# Altium project Remute-RF-FT.PrjPcb
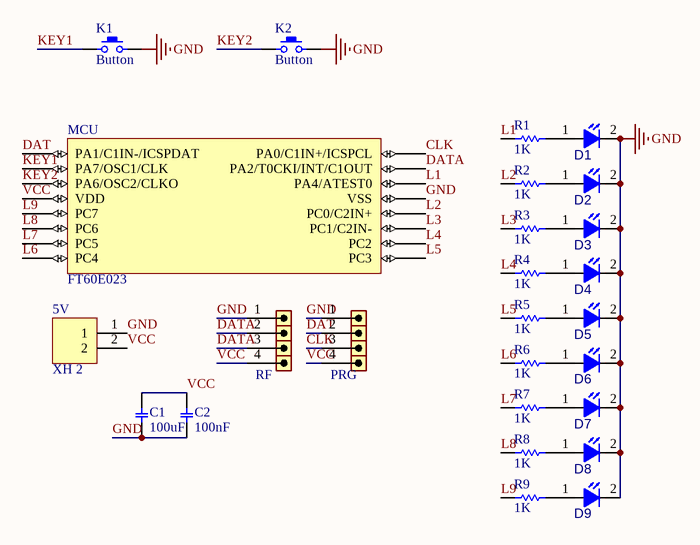
[diagram p0: Remute-RF-FT.SchDoc]
1 sheet, 26 parts. Net scope: global (net labels, ports and power ports of the same name join across sheets).
Board file: Remute-RF-FT.PcbDoc

## Sheet Remute-RF-FT.SchDoc
size C; SheetNumber: 1; SheetTotal: 1

### Parts
5V  XH 2  [XH 2 PIN ( White )]
C1  value 100uF  [C1206]  (hidden comment: Capacitor SMD 1206)
C2  value 100nF  [C1206]  (hidden comment: Capacitor SMD 1206)
D1  LED SMD 1206  [LED SMD 1206 (Blue)]  (value not drawn)
D2  LED SMD 1206  [LED SMD 1206 (Blue)]  (value not drawn)
D3  LED SMD 1206  [LED SMD 1206 (Blue)]  (value not drawn)
D4  LED SMD 1206  [LED SMD 1206 (Blue)]  (value not drawn)
D5  LED SMD 1206  [LED SMD 1206 (Blue)]  (value not drawn)
D6  LED SMD 1206  [LED SMD 1206 (Blue)]  (value not drawn)
D7  LED SMD 1206  [LED SMD 1206 (Blue)]  (value not drawn)
D8  LED SMD 1206  [LED SMD 1206 (Blue)]  (value not drawn)
D9  LED SMD 1206  [LED SMD 1206 (Blue)]  (value not drawn)
K1  Button  [BUTTON]
K2  Button  [BUTTON]
MCU  FT60E023  [SSOP-16]
PRG  Female Header Single 4  [HDR_F_1X4]  (value not drawn)
R1  value 1K  [R0805]  (hidden comment: Resistor SMD 0805)
R2  value 1K  [R0805]  (hidden comment: Resistor SMD 0805)
R3  value 1K  [R0805]  (hidden comment: Resistor SMD 0805)
R4  value 1K  [R0805]  (hidden comment: Resistor SMD 0805)
R5  value 1K  [R0805]  (hidden comment: Resistor SMD 0805)
R6  value 1K  [R0805]  (hidden comment: Resistor SMD 0805)
R7  value 1K  [R0805]  (hidden comment: Resistor SMD 0805)
R8  value 1K  [R0805]  (hidden comment: Resistor SMD 0805)
R9  value 1K  [R0805]  (hidden comment: Resistor SMD 0805)
RF  Female Header Single 4  [HDR_F_1X4]  (value not drawn)

### Nets
GND: 5V.1 C1.1 C2.1 D1.2(CATHODE) D2.2(CATHODE) D3.2(CATHODE) D4.2(CATHODE) D5.2(CATHODE) D6.2(CATHODE) D7.2(CATHODE) D8.2(CATHODE) D9.2(CATHODE) K1.2 K2.2 MCU.13(VSS) PRG.1 RF.1
CLK: MCU.16(PA0/C1IN+/ICSPCL) PRG.3
DAT: MCU.1(PA1/C1IN-/ICSPDAT) PRG.2
DATA: MCU.15(PA2/T0CKI/INT/C1OUT) RF.2 RF.3
KEY1: K1.1 MCU.2(PA7/OSC1/CLK)
KEY2: K2.1 MCU.3(PA6/OSC2/CLKO)
L1: MCU.14(PA4/ATEST0) R1.1
L2: MCU.12(PC0/C2IN+) R2.1
L3: MCU.11(PC1/C2IN-) R3.1
L4: MCU.10(PC2) R4.1
L5: MCU.9(PC3) R5.1
L6: MCU.8(PC4) R6.1
L7: MCU.7(PC5) R7.1
L8: MCU.6(PC6) R8.1
L9: MCU.5(PC7) R9.1
VCC: 5V.2 C1.2 C2.2 MCU.4(VDD) PRG.4 RF.4
NetD1_1: D1.1(ANODE) R1.2
NetD2_1: D2.1(ANODE) R2.2
NetD3_1: D3.1(ANODE) R3.2
NetD4_1: D4.1(ANODE) R4.2
NetD5_1: D5.1(ANODE) R5.2
NetD6_1: D6.1(ANODE) R6.2
NetD7_1: D7.1(ANODE) R7.2
NetD8_1: D8.1(ANODE) R8.2
NetD9_1: D9.1(ANODE) R9.2

### Library data of the parts
5V = Conector XH 2 Pin: ComponentLink1Description: Tarahiboard; ComponentLink1URL: https://www.tarahiboard.com/product/library-pack; DatasheetVersion: 2022
C1 C2 = Capacitor SMD 1206: Capacitor C SMD 1206; DatasheetVersion: 2022; ComponentLink1Description: Tarahiboard; ComponentLink1URL: https://www.tarahiboard.com
K1 K2 = BUTTON-6.3.4-SMD: Manufacturer: Panasonic; Manufacturer Part Number: EVQ-PE605T; Mechanical Life: 30000Cycles; Actuator Color: Brown; Voltage Rating (DC): 12V; Throw Configuration: SPST; Contact Resistance: 100mR; Operating Force: 2.4N; Current Rating: 50mA; Illumination Type: Non-Illuminated,Illuminated; Switch Travel: 0.25mm; Switch Function: Off-Mom; Actuator Type: Standard; Actuator Length: 1.5mm; Supplier 1: Digi-Key; RoHS: Yes; Category: Tactile Switches; Stock 1: 1845; Pricing 1: 1=0.42000, 10=0.41000, 25=0.38600, 100=0.33510, 250=0.30400, 500=0.28280, 1000=0.25452, 2500=0.23897, 5000=0.22200 (USD); Mount: Through Hole; Contact Plating: Silver; Min Operating Temperature: -30°C; Max Operating Temperature: 85°C; Packaging: Bulk; Package Quantity: 1000; Max Voltage Rating (DC): 12V; Contact Current Rating: 50mA; Termination: PC Pin; Electrical Life: 30000Cycles; Orientation: Straight; Series: EVQPE; Size: 3.5mm; REACH SVHC: No SVHC; Lead Free: Lead Free; RoHS Compliant: Yes; ComponentLink1URL: https://datasheet.ciiva.com/25603/0900766b810ad3e5-25603911.pdf?src-supplier=RSComponents; ComponentLink1Description: https://datasheet.ciiva.com/25603/0900766b810ad3e5-25603911.pdf?src-supplier=RSComponents; ComponentLink2URL: https://datasheet.ciiva.com/30091/atv0000ce8-30091136.pdf?src-supplier=Onlinecomponents.com; ComponentLink2Description: https://datasheet.ciiva.com/30091/atv0000ce8-30091136.pdf?src-supplier=Onlinecomponents.com; ComponentLink3URL: https://datasheet.ciiva.com/16377/atk0000ce35-16377527.pdf?src-supplier=Future+Electronics; ComponentLink3Description: https://datasheet.ciiva.com/16377/atk0000ce35-16377527.pdf?src-supplier=Future+Electronics; ComponentLink4URL: https://datasheet.ciiva.com/16155/atv0000ce8-16155306.pdf?src-supplier=Onlinecomponents.com; ComponentLink4Description: https://datasheet.ciiva.com/16155/atv0000ce8-16155306.pdf?src-supplier=Onlinecomponents.com; Supplier Part Number 1: P13592S-ND; Supplier 2: Digi-Key
PRG RF = Female Header Single 4: Female, pitch: 2.54mm; ComponentLink1Description: Tarahiboard; ComponentLink1URL: https://www.tarahiboard.com/product/library-pack; DatasheetVersion: 2022
D1-D9 = LED SMD 1206: ComponentLink1Description: Tarahiboard; ComponentLink1URL: https://www.tarahiboard.com/product/library-pack; DatasheetVersion: 2022
R1-R9 = Resistor SMD 0805: DatasheetVersion: 2022; ComponentLink1Description: Website: Tarahiboard; ComponentLink1URL: https://www.tarahiboard.com/product/library-pack